# EAGLE design sc_open-short_tester (EAGLE 5.03)
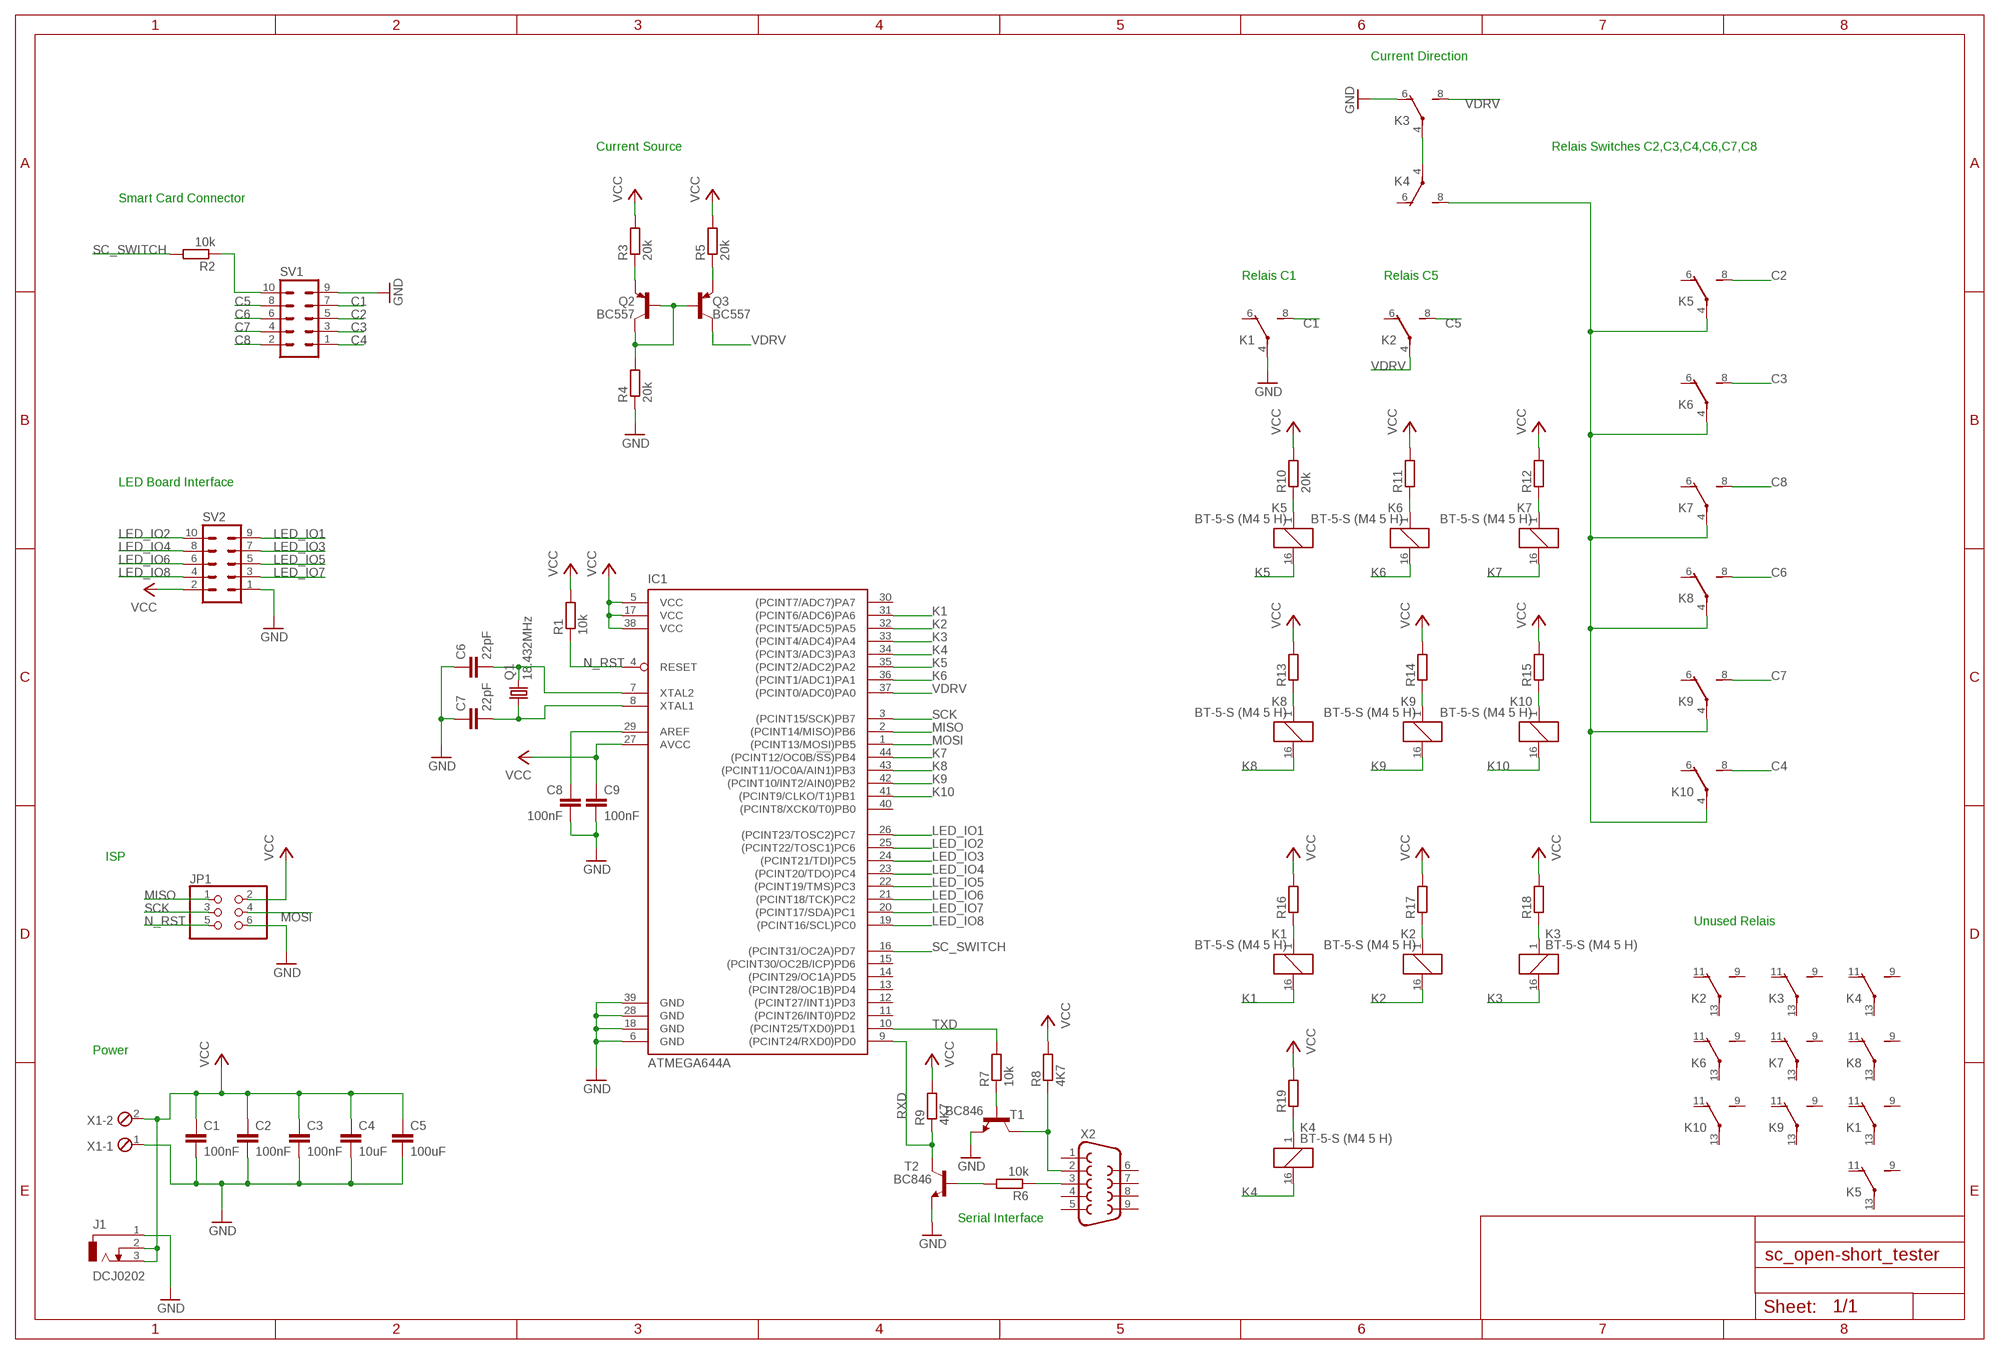
[diagram p0: schematic, sheet 1]

## Parts
C1  100nF  C-EUC0805  [C0805]
C2  100nF  C-EUC0805  [C0805]
C3  100nF  C-EUC0805  [C0805]
C4  10uF  C2.5/6  [C2.5-6]
C5  100uF  C2.5/6  [C2.5-6]
C6  22pF  C-EUC0805  [C0805]
C7  22pF  C-EUC0805  [C0805]
C8  100nF  C-EUC0805  [C0805]
C9  100nF  C-EUC0805  [C0805]
IC1  ATMEGA644A  [TQFP44]
J1  DCJ0202  [DCJ0202]
JP1  PINHD-2X3  [2X03]
K1  BT-5-S (M4 5 H)  BT-5-S  [BT-XX-S]
K2  BT-5-S (M4 5 H)  BT-5-S  [BT-XX-S]
K3  BT-5-S (M4 5 H)  BT-5-S  [BT-XX-S]
K4  BT-5-S (M4 5 H)  BT-5-S  [BT-XX-S]
K5  BT-5-S (M4 5 H)  BT-5-S  [BT-XX-S]
K6  BT-5-S (M4 5 H)  BT-5-S  [BT-XX-S]
K7  BT-5-S (M4 5 H)  BT-5-S  [BT-XX-S]
K8  BT-5-S (M4 5 H)  BT-5-S  [BT-XX-S]
K9  BT-5-S (M4 5 H)  BT-5-S  [BT-XX-S]
K10  BT-5-S (M4 5 H)  BT-5-S  [BT-XX-S]
Q1  18.432MHz  CRYSTALHC49UP  [HC49UP]
Q2  BC557  [TO92]
Q3  BC557  [TO92]
R1  10k  R-EU_R0805  [R0805]
R2  10k  R-EU_R0805  [R0805]
R3  20k  R-EU_R0805  [R0805]
R4  20k  R-EU_R0805  [R0805]
R5  20k  R-EU_R0805  [R0805]
R6  10k  R-EU_R0805  [R0805]
R7  10k  R-EU_R0805  [R0805]
R8  4K7  R-EU_R0805  [R0805]
R9  4K7  R-EU_R0805  [R0805]
R10  20k  R-EU_R0805  [R0805]
R11  R-EU_R0805  [R0805]
R12  R-EU_R0805  [R0805]
R13  R-EU_R0805  [R0805]
R14  R-EU_R0805  [R0805]
R15  R-EU_R0805  [R0805]
R16  R-EU_R0805  [R0805]
R17  R-EU_R0805  [R0805]
R18  R-EU_R0805  [R0805]
R19  R-EU_R0805  [R0805]
SV1  ML10  [ML10]
SV2  ML10  [ML10]
T1  BC846  [SOT23]
T2  BC846  [SOT23]
X1  MPT2  [2POL254]
X2  F09H  [F09H]

## Nets
C1: K1.8(-1:S) SV1.7
C2: K5.8(-1:S) SV1.5
C3: K6.8(-1:S) SV1.3
C4: K10.8(-1:S) SV1.1
C5: K2.8(-1:S) SV1.8
C6: K8.8(-1:S) SV1.6
C7: K9.8(-1:S) SV1.4
C8: K7.8(-1:S) SV1.2
GND: C1.2 C2.2 C3.2 C4.2 C5.2 C6.1 C7.1 C8.2 C9.2 IC1.6(GND) IC1.18(GND) IC1.28(GND) IC1.39(GND) J1.1 JP1.6 K1.4(-1:P) K3.6(-1:O) R4.1 SV1.9 SV2.1 T1.2(E) T2.2(E) X1.1
K1: K1.16
K2: K2.16
K3: K3.16
K4: K4.16
K5: K5.16
K6: K6.16
K7: K7.16
K8: K8.16
K9: K9.16
K10: K10.16
LED_IO1: IC1.26((PCINT23/TOSC2)PC7) SV2.9
LED_IO2: IC1.25((PCINT22/TOSC1)PC6) SV2.10
LED_IO3: IC1.24((PCINT21/TDI)PC5) SV2.7
LED_IO4: IC1.23((PCINT20/TDO)PC4) SV2.8
LED_IO5: IC1.22((PCINT19/TMS)PC3) SV2.5
LED_IO6: IC1.21((PCINT18/TCK)PC2) SV2.6
LED_IO7: IC1.20((PCINT17/SDA)PC1) SV2.3
LED_IO8: IC1.19((PCINT16/SCL)PC0) SV2.4
MISO: IC1.2((PCINT14/MISO)PB6) JP1.1
MOSI: IC1.1((PCINT13/MOSI)PB5) JP1.4
N$1: C6.2 IC1.7(XTAL2) Q1.2
N$2: C7.2 IC1.8(XTAL1) Q1.1
N$3: R6.1 X2.3
N$4: R8.1 T1.3(C) X2.2
N$5: R7.1 T1.1(B)
N$6: C8.1 IC1.29(AREF)
N$7: R2.1 SV1.10
N$8: K3.4(-1:P) K4.4(-1:P)
N$9: K4.8(-1:S) K5.4(-1:P) K6.4(-1:P) K7.4(-1:P) K8.4(-1:P) K9.4(-1:P) K10.4(-1:P)
N$10: R6.2 T2.1(B)
N$11: K5.1 R10.1
N$12: K6.1 R11.1
N$13: K7.1 R12.1
N$14: K8.1 R13.1
N$15: Q2.2(B) Q2.3(C) Q3.2(B) R4.2
N$16: Q2.1(E) R3.1
N$17: K9.1 R14.1
N$18: Q3.1(E) R5.1
N$19: K10.1 R15.1
N$20: K1.1 R16.1
N$21: K4.1 R19.1
N$22: K2.1 R17.1
N$23: K3.1 R18.1
N_RST: IC1.4(RESET) JP1.5 R1.1
RXD: IC1.9((PCINT24/RXD0)PD0) R9.1 T2.3(C)
SC_SWITCH: IC1.16((PCINT31/OC2A)PD7) R2.2
SCK: IC1.3((PCINT15/SCK)PB7) JP1.3
TXD: IC1.10((PCINT25/TXD0)PD1) R7.2
VCC: C1.1 C2.1 C3.1 C4.1 C5.1 C9.1 IC1.5(VCC) IC1.17(VCC) IC1.27(AVCC) IC1.38(VCC) J1.2 J1.3 JP1.2 R1.2 R3.2 R5.2 R8.2 R9.2 R10.2 R11.2 R12.2 R13.2 R14.2 R15.2 R16.2 R17.2 R18.2 R19.2 SV2.2 X1.2
VDRV: IC1.37((PCINT0/ADC0)PA0) K2.4(-1:P) K3.8(-1:S) Q3.3(C)
Unconnected: IC1.11((PCINT26/INT0)PD2) IC1.12((PCINT27/INT1)PD3) IC1.13((PCINT28/OC1B)PD4) IC1.14((PCINT29/OC1A)PD5) IC1.15((PCINT30/OC2B/ICP)PD6) IC1.30((PCINT7/ADC7)PA7) IC1.31((PCINT6/ADC6)PA6) IC1.32((PCINT5/ADC5)PA5) IC1.33((PCINT4/ADC4)PA4) IC1.34((PCINT3/ADC3)PA3) IC1.35((PCINT2/ADC2)PA2) IC1.36((PCINT1/ADC1)PA1) IC1.40((PCINT8/XCK0/T0)PB0) IC1.41((PCINT9/CLKO/T1)PB1) IC1.42((PCINT10/INT2/AIN0)PB2) IC1.43((PCINT11/OC0A/AIN1)PB3) IC1.44((PCINT12/OC0B/!SS!)PB4) K1.6(-1:O) K1.9(-2:S) K1.11(-2:O) K1.13(-2:P) K2.6(-1:O) K2.9(-2:S) K2.11(-2:O) K2.13(-2:P) K3.9(-2:S) K3.11(-2:O) K3.13(-2:P) K4.6(-1:O) K4.9(-2:S) K4.11(-2:O) K4.13(-2:P) K5.6(-1:O) K5.9(-2:S) K5.11(-2:O) K5.13(-2:P) K6.6(-1:O) K6.9(-2:S) K6.11(-2:O) K6.13(-2:P) K7.6(-1:O) K7.9(-2:S) K7.11(-2:O) K7.13(-2:P) K8.6(-1:O) K8.9(-2:S) K8.11(-2:O) K8.13(-2:P) K9.6(-1:O) K9.9(-2:S) K9.11(-2:O) K9.13(-2:P) K10.6(-1:O) K10.9(-2:S) K10.11(-2:O) K10.13(-2:P) X2.1 X2.4 X2.5 X2.6 X2.7 X2.8 X2.9

## Notes on the sheet
- Current Direction
- Current Source | Relais Switches C2,C3,C4,C6,C7,C8
- Smart Card Connector
- Relais C1 | Relais C5
- LED Board Interface
- ISP
- Unused Relais
- Power
- Serial Interface

## Library data of the parts
C1-C3 C6-C9 = rcl:C-EU: CAPACITOR, European symbol
C4 C5 = capacitor-wima:C: CAPACITOR naming: grid - package width
IC1 = atmel:ATMEGA644: 8-bit Microcontroller with 64K Bytes In-System Programmable Flash Source: http://www.atmel.com/dyn/resources/prod_documents/doc2593.pdf; MPN: ATMEGA644PV-10AU; OC_FARNELL: 1455123; OC_NEWARK: 58M3748
J1 = con-jack:DCJ0202: DC POWER JACK Source: DCJ0202.pdf; OC_FARNELL: unknown; OC_NEWARK: unknown
JP1 = pinhead:PINHD-2X3: PIN HEADER
K1-K10 = relay:BT-*-S: KLEIN RELAIS WASCHDICHT 2 Wechsler Distriibutor: Conrad Electronic, Bestell Nr.: 505226-13 - 24V 505226-13 - 5V 505170-13 - 12V 505170-13 - 48V Bestar Electric Ltd. Source: http://www2.produktinfo.conrad.com/datenblaetter/500000-524999/505226-da-01-en-Kleinrelais_waschdicht_24V.pdf; OC_FARNELL: unknown; OC_NEWARK: unknown
Q1 = crystal:CRYSTAL: CRYSTAL; OC_FARNELL: unknown; OC_NEWARK: unknown
Q2 Q3 = transistor-pnp:BC557: PNP Transistor
R1-R10 = rcl:R-EU_: RESISTOR, European symbol
R11-R19 = resistor:R-EU_: RESISTOR, European symbol
SV1 SV2 = con-harting-ml:ML10: HARTING
T1 T2 = transistor:BC846: NPN TRANSISTOR
X1 = con-phoenix-254:MPT2: PHOENIX CONNECTOR; OC_FARNELL: unknown; OC_NEWARK: unknown
X2 = con-subd:F09: SUB-D; OC_FARNELL: unknown; OC_NEWARK: unknown

## Board
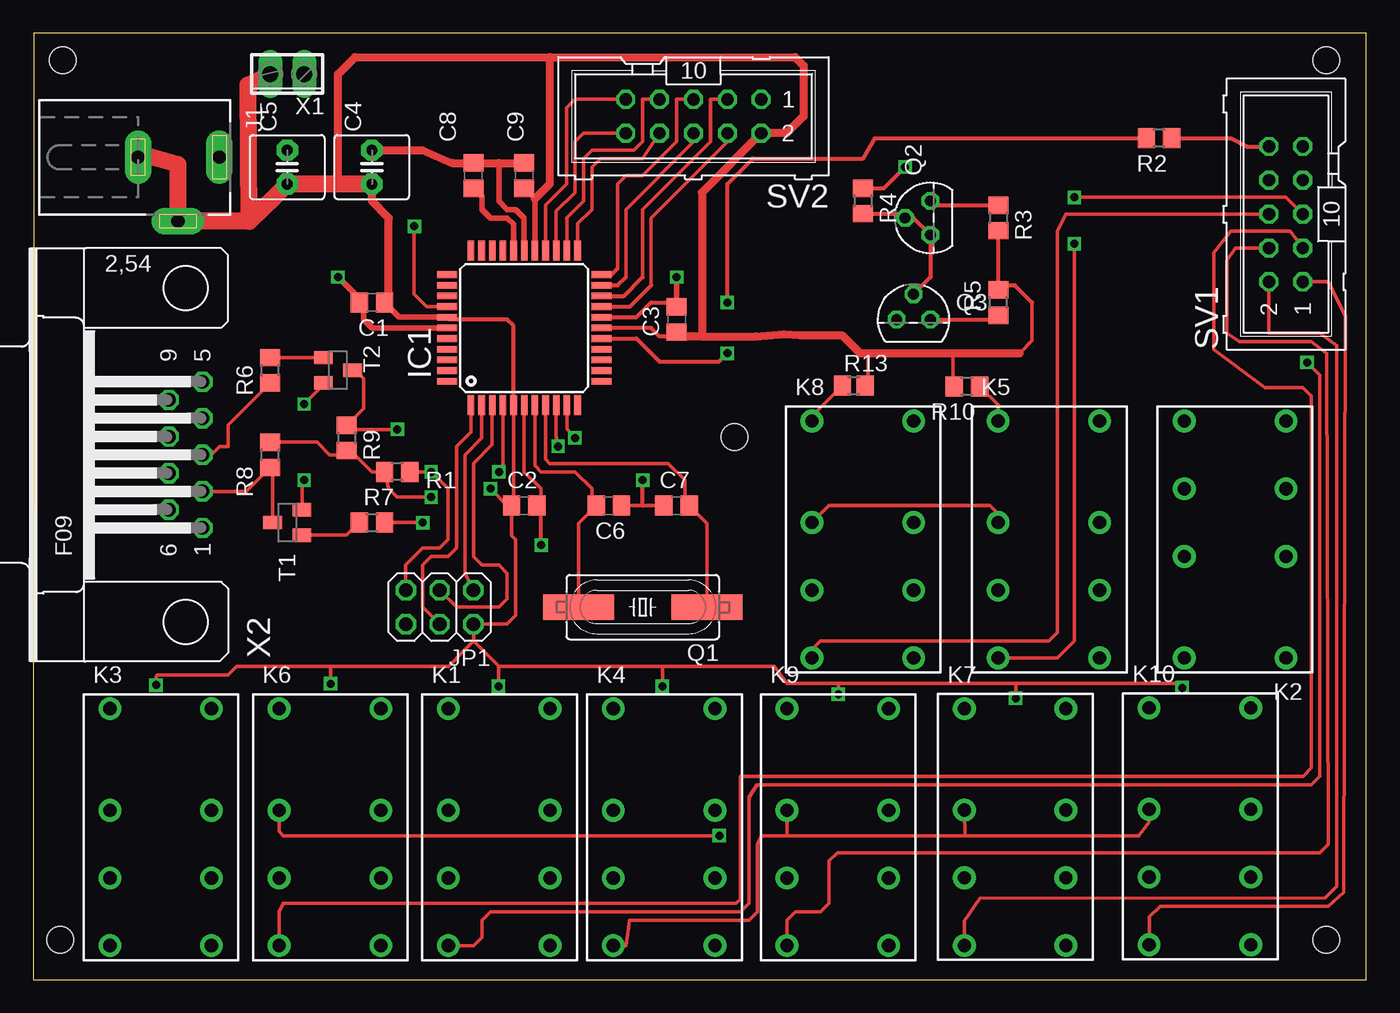
[diagram p1: board, top side]
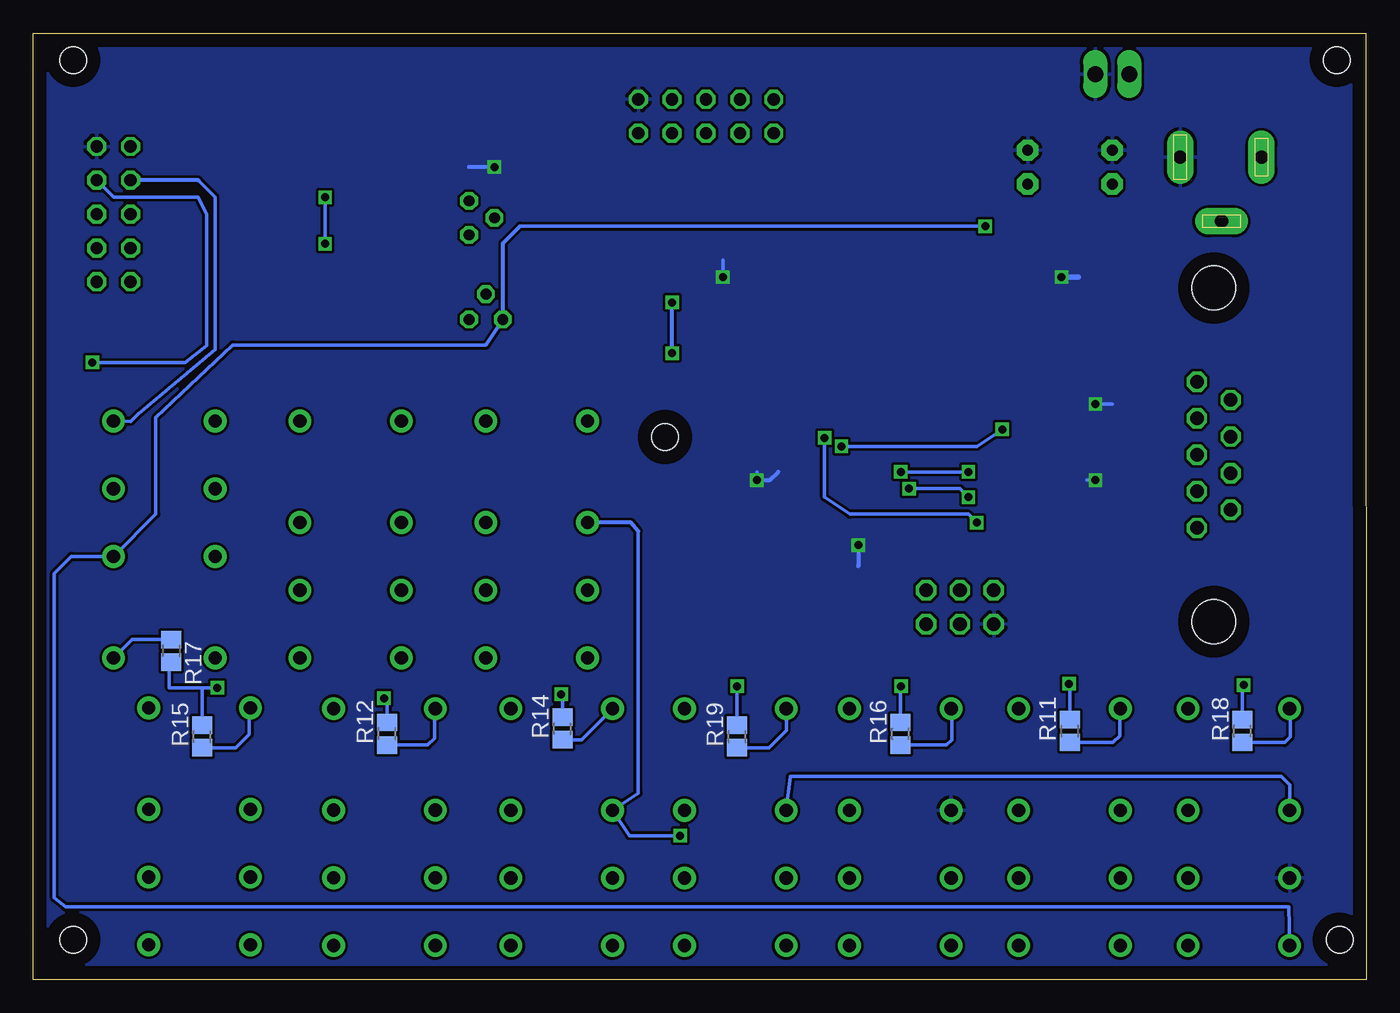
[diagram p2: board, bottom side, seen from below]

Size 100 x 71 mm. Coordinates in mm from the lower left corner, seen from the top.
Outline: 0,0 100,0 100,71 0.04,71 0,0
Copper layers (1*16): Top 0.035mm / dielectric 1.5mm / Bottom 0.035mm
Design rules "default": minimum track width 10mil, minimum drill 24mil, track to track 8mil, track to pad 8mil, pad to pad 8mil, via to via 8mil, smd to smd 8mil, copper to edge 40mil, drill to drill 8mil, minimum pad ring 10mil, minimum via ring 8mil, stop-mask expansion 4mil, vias tented up to drill 0mil, thermal gap 10mil
Holes 2 mm at 2,3 97,3 2.2,69 52.6,40.7 97,69

### Footprints (pad centres in the part's own frame; a part is rotated, then mirrored left to right if it is on the bottom)
C0805 = smd 1.3 x 1.5: 1 -0.95,0; 2 0.95,0
C2.5-6 = drill 0.813 pad 1.6 octagon: 1 -1.27,0; 2 1.27,0
TQFP44 = smd 1.5 x 0.5: 1 -5.8,4; 2 -5.8,3.2; 3 -5.8,2.4; 4 -5.8,1.6; 5 -5.8,0.8; 6 -5.8,0; 7 -5.8,-0.8; 8 -5.8,-1.6; 9 -5.8,-2.4; 10 -5.8,-3.2; 11 -5.8,-4; 23 5.8,-4; 24 5.8,-3.2; 25 5.8,-2.4; 26 5.8,-1.6; 27 5.8,-0.8; 28 5.8,0; 29 5.8,0.8; 30 5.8,1.6; 31 5.8,2.4; 32 5.8,3.2; 33 5.8,4 | smd 0.5 x 1.5: 12 -4,-5.8; 13 -3.2,-5.8; 14 -2.4,-5.8; 15 -1.6,-5.8; 16 -0.8,-5.8; 17 0,-5.8; 18 0.8,-5.8; 19 1.6,-5.8; 20 2.4,-5.8; 21 3.2,-5.8; 22 4,-5.8; 34 4,5.8; 35 3.2,5.8; 36 2.4,5.8; 37 1.6,5.8; 38 0.8,5.8; 39 0,5.8; 40 -0.8,5.8; 41 -1.6,5.8; 42 -2.4,5.8; 43 -3.2,5.8; 44 -4,5.8
DCJ0202 = drill 1 pad 2 long: 1 0,3.1; 2 4.8,0; 3 0,-3
2X03 = drill 1.016 octagon: 1 -2.54,-1.27; 2 -2.54,1.27; 3 0,-1.27; 4 0,1.27; 5 2.54,-1.27; 6 2.54,1.27
BT-XX-S = drill 1 pad 1.7 round: 1 -8.89,-3.81; 4 -1.27,-3.81; 6 3.81,-3.81; 8 8.89,-3.81; 9 8.89,3.81; 11 3.81,3.81; 13 -1.27,3.81; 16 -8.89,3.81
HC49UP = smd 5.334 x 1.93: 1 -4.826,0; 2 4.826,0
TO92 = drill 0.813 octagon: 1 1.27,0; 2 0,1.905; 3 -1.27,0
R0805 = smd 1.3 x 1.5: 1 -0.95,0; 2 0.95,0
R0805' = smd 1.3 x 1.5: 1 -0.85,0; 2 0.85,0
ML10 = drill 0.914 octagon: 1 -5.08,-1.27; 2 -5.08,1.27; 3 -2.54,-1.27; 4 -2.54,1.27; 5 0,-1.27; 6 0,1.27; 7 2.54,-1.27; 8 2.54,1.27; 9 5.08,-1.27; 10 5.08,1.27
SOT23 = smd 1 x 1.4: 1 -0.95,-1.1; 2 0.95,-1.1; 3 0,1.1
2POL254 = drill 1.2 long: 1 -1.27,0; 2 1.27,0
F09H = drill 1.016 octagon: 1 -5.486,-1.27; 2 -2.743,-1.27; 3 0,-1.27; 4 2.743,-1.27; 5 5.486,-1.27; 6 -4.115,1.27; 7 -1.372,1.27; 8 1.372,1.27; 9 4.115,1.27 | hole 3.302: -12.522,0; 12.522,0

### Placement (x,y rotation side)
C1  25.4,50.8 180 top
C2  36.83,35.56 0 top
C3  48.26,49.53 90 top
C4  25.4,60.96 90 top
C5  19.05,60.96 90 top
C6  43.18,35.56 180 top
C7  48.26,35.56 0 top
C8  33.02,60.33 90 top
C9  36.83,60.33 90 top
IC1  36.83,48.9 90 top
J1  10.86,61.7 270 top
JP1  30.48,27.94 180 top
K1  34.96,11.43 270 top
K2  90.17,33.02 90 top
K3  9.56,11.43 270 top
K4  47.33,11.43 270 top
K5  76.2,33.02 270 top
K6  22.26,11.43 270 top
K7  73.66,11.44 270 top
K8  62.23,33.02 270 top
K9  60.36,11.43 270 top
K10  87.53,11.49 270 top
Q1  45.72,27.94 180 top
Q2  67.31,57.15 90 top
Q3  66.04,49.53 0 top
R1  27.3,38.1 180 top
R2  84.46,63.13 180 top
R3  72.39,57.15 270 top
R4  62.23,58.42 270 top
R5  72.39,50.8 90 top
R6  17.78,45.72 90 top
R7  25.4,34.29 0 top
R8  17.78,39.37 90 top
R9  23.5,40.64 270 top
R10  70.04,44.51 180 top
R11  [R0805']  22.24,18.64 90 bottom
R12  [R0805']  73.46,18.44 90 bottom
R13  [R0805']  61.56,44.58 0 top
R14  [R0805']  60.3,18.84 90 bottom
R15  [R0805']  87.32,18.24 90 bottom
R16  [R0805']  34.94,18.44 90 bottom
R17  [R0805']  89.64,24.66 270 bottom
R18  [R0805']  9.28,18.64 90 bottom
R19  [R0805']  47.2,18.24 90 bottom
SV1  93.98,57.43 90 top
SV2  49.53,64.77 180 top
T1  19.05,34.29 90 top
T2  22.86,45.72 270 top
X1  19.05,67.94 180 top
X2  11.43,39.37 90 top

### Tracks (layer width: path | path; a pad name or v marks a point on that pad's centre or on a via)
C1  (via drill 0.6)
  Top 0.254: K1.8 33.02,2.54 33.66,3.17 33.66,4.45 34.29,5.08 53.05,5.08 53.68,5.71 53.68,13.66 54.31,14.61 95.89,14.61 96.52,15.24 96.52,45.35 v95.57,46.3
  Bottom 0.254: SV1.7 93.98,58.7 87.63,58.7 87,57.42 87,47.58 88.6,46.3 v95.57,46.3
C2  (via drill 0.6)
  Top 0.254: K5.8 76.83,24.13 78.11,25.4 v78.11,55.2 | SV1.5 93.97,58.7 v78.11,58.7
  Bottom 0.254: v78.11,55.2 v78.11,58.7
C3
  Top 0.254: K6.8 18.45,5.08 18.76,5.71 52.73,5.71 53.05,6.03 53.05,15.24 95.27,15.24 95.89,15.88 95.89,43.8 95.25,44.43 92.4,44.43 88.58,47.28 88.58,54.56 89.86,56.16 94.29,56.16 SV1.3
C4
  Top 0.254: K10.8 83.72,4.71 84.56,5.48 97.16,5.48 98.33,6.55 98.42,49.79 97.16,52.35 SV1.1
C5
  Bottom 0.254: K2.8 92.69,41.88 92.13,42.44 86.36,47.28 86.36,58.71 87.63,59.97
  Bottom 0.305: 87.63,59.97 SV1.8
C6
  Top 0.254: K8.8 58.42,24.77 59.05,25.4 76.2,25.4 76.83,26.04 76.83,56.15 77.47,57.43 SV1.6
C7
  Top 0.254: K9.8 56.55,4.45 57.18,5.08 59.05,5.08 59.69,5.71 59.69,8.89 60.33,9.53 96.52,9.53 97.16,10.16 97.06,46.97 95.88,47.89 90.49,47.89 89.53,48.52 89.53,53.93 90.17,54.89 SV1.4
C8
  Top 0.254: K7.8 69.85,4.41 71.02,6.08 96.92,6.12 97.79,6.99 97.79,47.55 96.51,48.51 92.7,48.51 92.71,52.37 SV1.2
GND  (via drill 0.6)
  Top 0.254: IC1.6 36.83,38.1 38.1,36.83 38.1,35.88 C2.2 | C6.1 45.72,35.56 C7.1 | T2.2 21.76,44.62 v20.32,43.18 | T1.2 20.15,37.3 v20.32,37.47
  Top 0.305: IC1.18 45.25,49.7 46.35,50.8 47.94,50.8 C3.2 | R4.1 63.81,59.37 v65.41,60.96 | 45.72,35.56 v45.72,37.47 | v38.1,32.6 38.1,35.88
  Top 0.406: IC1.28 36.83,57.15 36.2,57.78 35.56,57.78 34.92,58.42 34.92,61.27 | C3.2 v48.26,52.7 | IC1.39 25.4,48.9 24.77,49.53 24.77,50.48 C1.2 24.45,51.12 v22.86,52.7
  Top 0.61: C9.2 34.92,61.27 C8.2 31.43,61.27 29.21,62.23 C4.2
  Bottom 0.254: v45.72,37.47 45.72,38.1 | 19.05,43.18 v20.32,43.18 | v20.32,37.47 20.95,37.47 | v48.26,52.7 48.26,53.98
  Bottom 0.305: v65.41,60.96 67.31,60.96 | v45.72,37.47 44.73,37.47 44.1,38.1 | v38.1,32.6 38.1,31.1 38.1,31
  Bottom 0.406: 21.59,52.7 v22.86,52.7
  pour Bottom: 0.64,70.48 99.06,70.48 99.69,70.48 99.69,0.64 0.64,0.64
LED_IO1
  Top 0.254: IC1.26 38.43,58.12 40.01,59.69 40.01,65.41 40.64,66.04 SV2.9
LED_IO2
  Top 0.254: IC1.25 39.23,57.65 40.64,59.05 40.64,62.87 41.27,63.5 SV2.10
LED_IO3
  Top 0.254: IC1.24 40.03,57.12 40.01,57.15 41.27,58.42 41.27,61.59 41.91,62.23 45.09,62.23 45.72,62.87 45.72,66.04 SV2.7
LED_IO4
  Top 0.254: IC1.23 40.83,56.7 41.91,57.78 41.91,60.96 42.55,61.59 45.72,61.59 SV2.8
LED_IO5
  Top 0.254: 43.81,53.34 43.81,59.69 44.45,60.33 45.72,60.33 48.26,62.87 48.26,66.04 SV2.5
  Top 0.305: IC1.22 43.37,52.9 43.81,53.34
LED_IO6
  Top 0.254: 44.45,52.7 44.45,57.78 49.53,62.87 SV2.6
  Top 0.305: IC1.21 43.84,52.09 44.45,52.7
LED_IO7
  Top 0.254: 45.72,52.7 45.72,57.78 50.8,62.87 50.8,66.04 SV2.3
  Top 0.305: IC1.20 44.31,51.3 45.72,52.7
LED_IO8
  Top 0.254: 46.35,52.07 46.35,57.15 52.07,62.87
  Top 0.305: IC1.19 44.78,50.49 46.35,52.07 | 52.07,62.87 SV2.4
MISO
  Top 0.254: IC1.2 33.63,40.62 32.38,39.37 32.38,30.48 JP1.1
MOSI
  Top 0.254: IC1.1 32.83,41.09 31.75,40.01 31.75,32.38 31.11,31.75 29.84,31.75 29.21,31.11 29.21,27.94 JP1.4
N$1
  Top 0.254: IC1.7 37.63,38.57 38.1,38.1 40.64,38.1 41.91,36.83 41.91,35.88 C6.2 40.89,34.22 Q1.2
N$2
  Top 0.254: IC1.8 38.43,39.04 38.73,38.73 47.62,38.73 48.9,37.47 48.9,35.88 C7.2 50.55,34.22 Q1.1
N$3
  Top 0.254: X2.3 13.34,39.37 13.97,40.01 14.61,40.01 14.61,41.59 R6.1
N$4
  Top 0.254: X2.2 15.99,36.63 R8.1 17.95,38.25 T1.3
N$5
  Top 0.254: T1.1 23.5,33.34 R7.1
N$6
  Top 0.406: IC1.29 36.03,56.68 35.56,57.15 34.29,57.15 33.66,57.78 33.66,58.74 C8.1
N$7
  Top 0.305: R2.1 89.83,63.13 91.1,62.5 SV1.10
N$8
  Bottom 0.254: K3.4 5.75,14.61 6.38,15.24 43.2,15.24 K4.4
N$9  (via drill 0.6)
  Top 0.254: K4.8 44.45,2.54 44.74,4.45 53.68,4.45 54.32,5.08 54.32,10.16 54.63,10.79 56.55,10.79 | K9.4 56.55,10.79 | 56.55,10.79 69.89,10.79 | 69.89,10.79 K7.4 | 69.89,10.79 82.96,10.79 83.69,11.78 K10.4 | 72.39,34.92 71.75,35.56 59.69,35.56 K8.4 | K6.4 18.45,11.11 18.76,10.79 v51.47,10.79
  Top 0.305: 72.39,34.92 K5.4
  Bottom 0.254: 54.62,33.66 54.62,13.97 56.53,12.7 K9.4 55.29,10.79 v51.47,10.79
  Bottom 0.305: 54.62,33.66 55.15,34.29 K8.4
N$10
  Top 0.254: R6.2 T2.1
N$11
  Top 0.254: R10.1 72.39,43.11 K5.1
N$12
  Bottom 0.254: R11.1 19.01,17.79 18.5,18.3 18.5,20.27 K6.1
N$13
  Bottom 0.254: R12.1 70.41,17.59 69.9,18.1 69.9,20.28 K7.1
N$14
  Top 0.254: R13.1 58.42,42.29 K8.1
N$15
  Top 0.305: R4.2 65.08,57.47 Q2.2 66.04,57.15 Q2.3 67.31,52.7 Q3.2
N$16
  Top 0.305: R3.1 67.63,58.1 Q2.1
N$17
  Bottom 0.254: R14.1 58.88,17.99 K9.1
N$18
  Top 0.305: Q3.1 72.07,49.53 R5.1
N$19
  Bottom 0.254: R15.1 84.81,17.39 83.8,18.4 83.8,20.3 K10.1
N$20
  Bottom 0.254: R16.1 31.51,17.59 31.1,18 31.1,20.27 K1.1
N$21
  Bottom 0.254: R19.1 44.81,17.39 43.5,18.7 43.5,20.3 K4.1
N$22
  Bottom 0.254: K2.1 92.6,25.51 R17.1
N$23
  Bottom 0.254: R18.1 6.11,17.79 5.7,18.2 5.7,20.27 K3.1
N_RST  (via drill 0.6)
  Top 0.254: IC1.4 35.23,38.41 v34.92,38.1 | R1.1 v29.84,38.1 31.11,36.83 31.11,33.02 30.48,32.38 29.21,32.38 27.94,31.11 JP1.5
  Bottom 0.254: v29.84,38.1 v34.92,38.1
RXD  (via drill 0.6)
  Top 0.254: T2.3 24.13,45.72 24.77,45.09 24.77,42.86 R9.1 23.81,41.27 v27.3,41.27 | IC1.9 39.23,40.78 v39.37,40.01
  Bottom 0.254: v39.37,40.01 29.21,40.01 v27.3,41.27
SC_SWITCH  (via drill 0.6)
  Top 0.305: IC1.16 45.25,48.09 46.99,46.35 51.44,46.35 v52.07,46.99 | v52.07,50.8 52.07,59.69 53.98,61.59 62.23,61.59 63.13,63.13 R2.2
  Bottom 0.305: v52.07,46.99 v52.07,50.8
SCK
  Top 0.254: IC1.3 34.43,40.15 33.02,38.73 33.02,31.75 33.66,31.11 34.92,31.11 35.56,30.48 35.56,28.57 34.92,27.94 31.75,27.94 JP1.3
TXD  (via drill 0.6)
  Top 0.254: IC1.10 40.03,41.3 v40.64,40.64 | R7.2 v29.21,34.29
  Bottom 0.254: v40.64,40.64 40.64,36.2 38.73,34.92 29.84,34.92 v29.21,34.29
VCC  (via drill 0.6)
  Top 0.254: IC1.5 36.03,35.71 C2.1 | R8.2 21.27,40.32 22.23,39.37 23.18,39.37 R9.2 23.81,39.69 25.4,38.1 R1.2 26.67,36.83 27.3,36.2 v29.84,36.2 | C2.1 35.88,33.34 36.2,33.02 36.2,27.3 35.56,26.67 JP1.2 33.02,25.4 | 33.02,25.4 34.92,23.5 | 33.02,25.4 31.75,24.13 31.78,24.13 31.14,23.5 22.2,23.5 | 22.2,23.5 15.24,23.5 14.61,22.86 9.3,22.86 9.2,22.76 v9.2,22.1 | 34.92,23.5 47.2,23.5 | 47.2,23.5 55.6,23.5 56.55,22.23 60.5,22.23 | 60.5,22.23 73.8,22.23 | C2.1 35.56,35.56 v34.29,36.83 | 74.93,50.8 74.93,47.93 74,47 | R13.2 62.6,44.77 62.6,47 | R10.2 69,44.6 69,47 | 73.8,22.23 85.88,22.23 v86.2,21.9 | v73.7,21.1 73.7,22.12 73.8,22.23 | v60.4,21.4 60.4,22.12 60.5,22.23 | 47.2,23.5 v47.2,22 | v34.9,22 34.9,23.47 34.92,23.5 | v22.3,22.2 22.3,23.39 22.2,23.5
  Top 0.305: IC1.17 46.35,48.9 46.99,48.26 47.94,48.26 C3.1 | R3.2 R5.2 72.71,52.07 73.66,52.07 74.93,50.8 | IC1.5 36.03,49.06 35.56,49.53 31.2,49.53 IC1.38
  Top 0.406: IC1.38 27.45,49.7 C1.1 | IC1.27 37.63,58.58 C9.1
  Top 0.61: C4.1 25.4,58.42 26.67,57.15 26.67,51.12 C1.1 | 38.73,69.22 24.13,69.22 22.86,67.94 22.86,59.69 | 38.73,69.22 57.15,69.22 57.78,68.58 57.78,64.77 56.52,63.5 SV2.2 50.16,59.05 50.16,48.26 | 37.63,58.58 37.63,58.59 38.73,59.69 38.73,69.22 | 50.16,48.26 48.26,48.26 C3.1 | 50.16,48.26 54.19,48.26 56.32,48.42 57.52,48.35 60.65,48.35 62,47 62.6,47 69,47 74,47
  Top 1.27: J1.3 8.92,61.7 10.86,61.16 J1.2 16.21,56.9 | 16.21,56.9 18.06,58.7 C5.1 22.86,59.69 C4.1 | X1.2 16.11,67.11 16.21,56.9
  Bottom 0.254: v34.29,36.83 30.48,36.83 v29.84,36.2 | R17.2 89.8,23.65 89.8,21.9 87.32,21.9 | 87.32,21.9 R15.2 | v86.2,21.9 87.32,21.9 | R12.2 73.46,20.86 v73.7,21.1 | R14.2 60.3,21.3 v60.4,21.4 | v47.2,22 R19.2 | R16.2 34.94,21.96 v34.9,22 | R11.2 22.24,22.14 v22.3,22.2 | R18.2 9.28,22.02 v9.2,22.1
VDRV  (via drill 0.6)
  Top 0.254: IC1.37 29.52,50.49 28.57,51.44 v28.57,56.52
  Bottom 0.254: 66.04,47.62 85.03,47.62 90.81,42.18 90.81,34.92 K2.4 97.16,31.75 98.42,30.48 98.42,6.12 97.58,5.45 5.82,5.45 K3.8 | 63.5,56.52 v28.57,56.52
  Bottom 0.305: 66.04,47.62 Q3.3 64.77,55.24 63.5,56.52